# EAGLE design ATTinyx5 Utility Board (EAGLE 7.1.0)
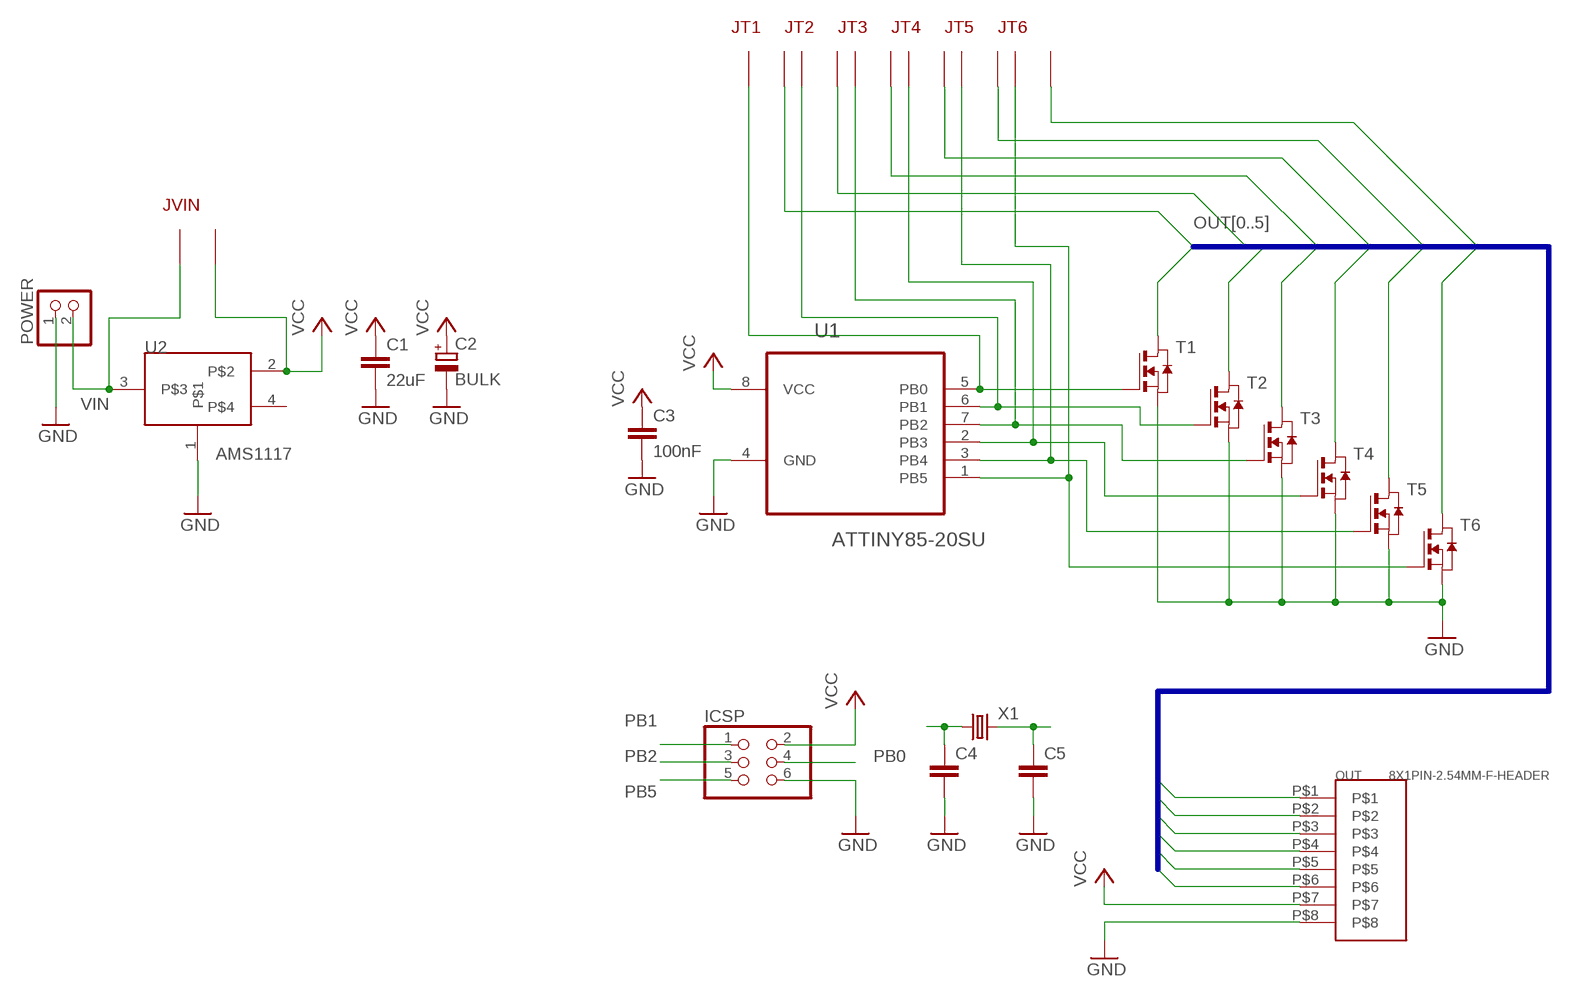
[diagram p0: schematic, sheet 1]

## Parts
C1  22uF  C-EUC1206  [C1206]
C2  BULK  CPOL-EUE3.5-10  [E3,5-10]
C3  100nF  C-EUC0805  [C0805]
C4  C-EUC0805  [C0805]
C5  C-EUC0805  [C0805]
ICSP  PINHD-2X3  [2X03]
JT1  SOLDER_JUMPER  [1206]
JT2  SOLDER_JUMPER  [1206]
JT3  SOLDER_JUMPER  [1206]
JT4  SOLDER_JUMPER  [1206]
JT5  SOLDER_JUMPER  [1206]
JT6  SOLDER_JUMPER  [1206]
JVIN  SOLDER_JUMPER  [1206]
OUT  8X1PIN-2.54MM-F-HEADER  [8X1-2.54MM]
POWER  PINHD-1X2  [1X02]
T1  NMOSSOT23  [SOT-23]
T2  NMOSSOT23  [SOT-23]
T3  NMOSSOT23  [SOT-23]
T4  NMOSSOT23  [SOT-23]
T5  NMOSSOT23  [SOT-23]
T6  NMOSSOT23  [SOT-23]
U1  ATTINY85-20SU  [SOIC127P798X216-8N]
U2  AMS1117  ASM1117-3.3  [SOT223]
X1  CRYSTALSM49  [SM49]

## Nets
GND: C1.2 C2.- C3.2 C4.2 C5.2 ICSP.6 OUT.P$8 POWER.1 T1.2(S) T2.2(S) T3.2(S) T4.2(S) T5.2(S) T6.2(S) U1.4(GND) U2.1
OUT0: JT1.P$2 OUT.P$1 T1.1(D)
OUT1: JT2.P$2 OUT.P$2 T2.1(D)
OUT2: JT3.P$2 OUT.P$3 T3.1(D)
OUT3: JT4.P$2 OUT.P$4 T4.1(D)
OUT4: JT5.P$2 OUT.P$5 T5.1(D)
OUT5: JT6.P$2 OUT.P$6 T6.1(D)
PB0: ICSP.4 JT1.P$1 T1.3(G) U1.5(PB0)
PB1: ICSP.1 JT2.P$1 T2.3(G) U1.6(PB1)
PB2: ICSP.3 JT3.P$1 T3.3(G) U1.7(PB2)
PB3: C4.1 JT4.P$1 T4.3(G) U1.2(PB3) X1.1
PB4: C5.1 JT5.P$1 T5.3(G) U1.3(PB4) X1.2
PB5: ICSP.5 JT6.P$1 T6.3(G) U1.1(PB5)
VCC: C1.1 C2.+ C3.1 ICSP.2 JVIN.P$2 OUT.P$7 U1.8(VCC) U2.2
VIN: JVIN.P$1 POWER.2 U2.3
Unconnected: U2.4

## Buses
OUT[0..5]

## Library data of the parts
C1 C3-C5 = rcl:C-EU: CAPACITOR, European symbol
C2 = rcl:CPOL-EU: POLARIZED CAPACITOR, European symbol
ICSP = pinhead:PINHD-2X3: PIN HEADER
JT1-JT6 JVIN = solder_jumper:SOLDER_JUMPER
OUT = Itead_BP_110825.lbr:8X1PIN-2.54MM-F-HEADER: CON019
POWER = pinhead:PINHD-1X2: PIN HEADER
T1-T6 = zetex:NMOSSOT23: MOS FET; OC_FARNELL: unknown; OC_NEWARK: unknown
U1 = Atmel_By_element14_Batch_1-00:ATTINY85-20SU: 8-bit Microcontroller with In-System Programmable Flash; MPN: ATTINY85-20SU; OC_FARNELL: 1455164; OC_NEWARK: 58M3797; PACKAGE: SOIC-8; SUPPLIER: Atmel
U2 = Itead_IC_110429:ASM1117-3.3: ICP006
X1 = adafruit:CRYSTAL: CRYSTAL; OC_FARNELL: unknown; OC_NEWARK: unknown

## Board
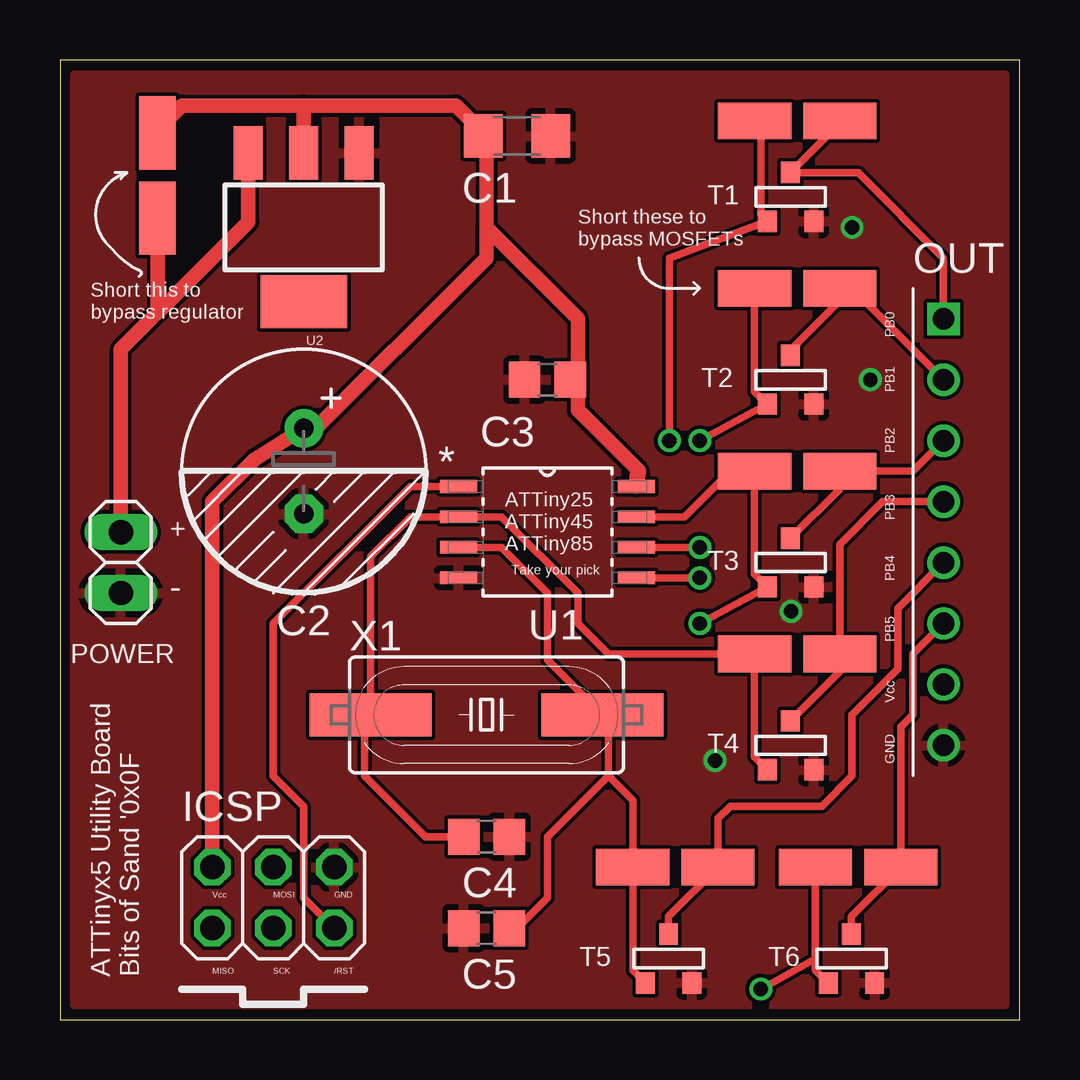
[diagram p1: board, top side]
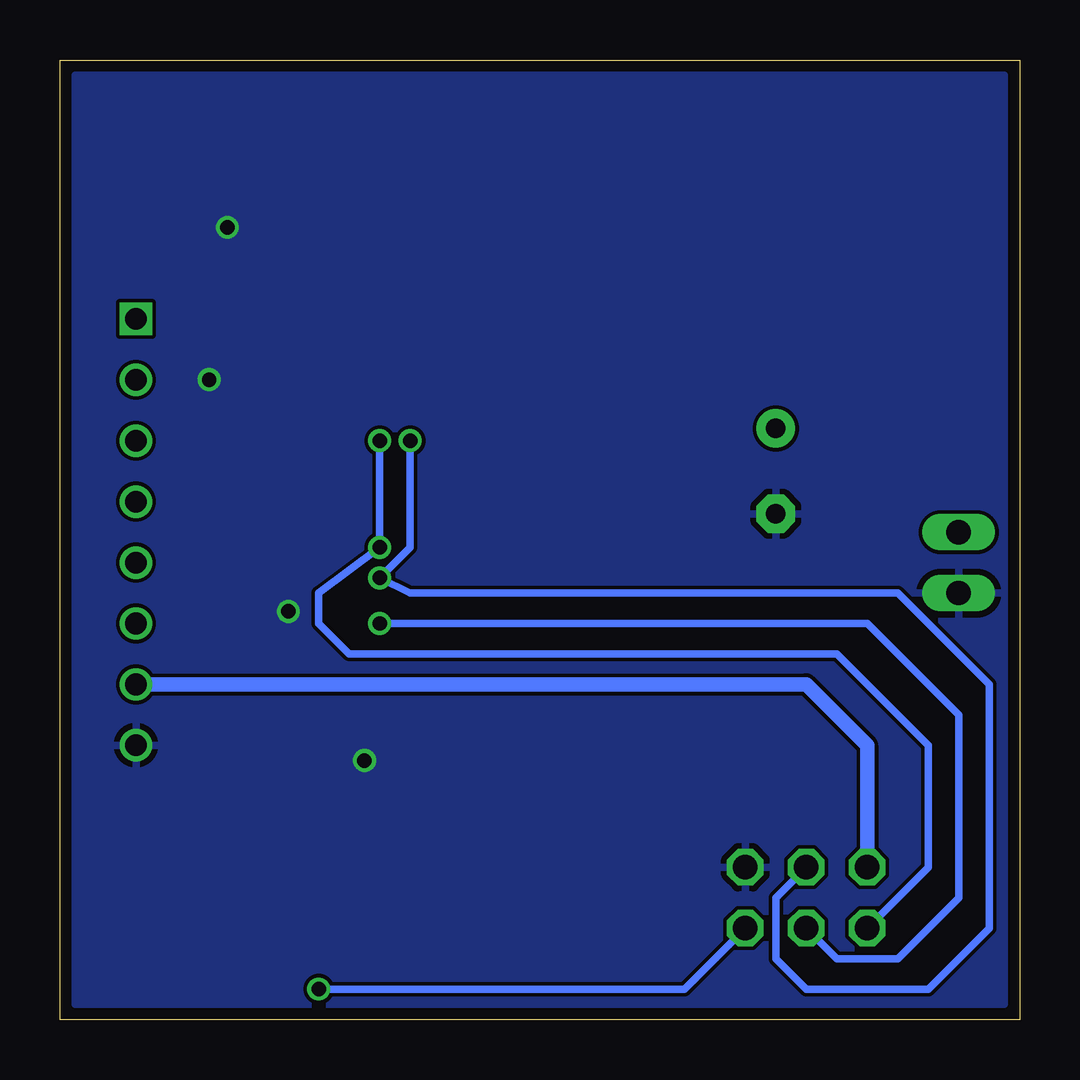
[diagram p2: board, bottom side, seen from below]

Size 40 x 40 mm. Coordinates in mm from the lower left corner, seen from the top.
Outline: 0,0 40,0 40,40 0,40 0,0
Copper layers (1*16): Top 0.0356mm / dielectric 1.5011mm / Bottom 0.0356mm
Design rules "LaenPCBOrder": minimum track width 6mil, minimum drill 13mil, track to track 6mil, track to pad 6mil, pad to pad 6mil, via to via 6mil, smd to smd 6mil, copper to edge 15mil, drill to drill 6mil, minimum pad ring 7mil, minimum via ring 7mil, stop-mask expansion 3mil, vias tented up to drill 0mil, thermal gap 10mil

### Footprints (pad centres in the part's own frame; a part is rotated, then mirrored left to right if it is on the bottom)
C1206 = smd 1.6 x 1.8: 1 -1.4,0; 2 1.4,0
E3,5-10 = drill 0.813 pad 1.6: + -1.778,0 | drill 0.813 pad 1.6 octagon: - 1.778,0
C0805 = smd 1.3 x 1.5: 1 -0.95,0; 2 0.95,0
2X03 = drill 1.016 octagon: 1 -2.54,-1.27; 2 -2.54,1.27; 3 0,-1.27; 4 0,1.27; 5 2.54,-1.27; 6 2.54,1.27
1206 = smd 3.048 x 1.524: P$1 -2.159,0; P$2 1.397,0
8X1-2.54MM = drill 0.9 square: P$1 0,0 | drill 0.9: P$2 0,-2.54; P$3 0,-5.08; P$4 0,-7.62; P$5 0,-10.16; P$6 0,-12.7; P$7 0,-15.24; P$8 0,-17.78
1X02 = drill 1.016 long: 1 -1.27,0; 2 1.27,0
SOT-23 = smd 0.787 x 0.889: 1 0.025,-1.016; 2 -0.94,1.016; 3 0.991,1.016
SOIC127P798X216-8N = smd 1.549 x 0.533: 1 -3.708,1.905; 2 -3.708,0.635; 3 -3.708,-0.635; 4 -3.708,-1.905; 5 3.708,-1.905; 6 3.708,-0.635; 7 3.708,0.635; 8 3.708,1.905
SOT223 = smd 1.219 x 2.235: 1 -2.311,-3.099; 2 0,-3.099; 3 2.311,-3.099 | smd 3.6 x 2.2: 4 0,3.099
SM49 = smd 5.08 x 1.778: 1 -4.826,0; 2 4.826,0

### Placement (x,y rotation side)
C1  19.05,36.83 0 top
C2  10.16,22.86 270 top
C3  20.32,26.67 180 top
C4  17.78,7.62 0 top
C5  17.78,3.81 180 top
ICSP  8.89,5.08 0 top
JT1  31.11,37.47 0 top
JT2  31.11,30.48 0 top
JT3  31.11,22.86 0 top
JT4  31.11,15.24 0 top
JT5  26.04,6.35 0 top
JT6  33.66,6.35 0 top
JVIN  4.06,35.56 90 top
OUT  36.83,29.21 0 top
POWER  2.54,19.05 90 top
T1  30.48,34.29 180 top
T2  30.48,26.67 180 top
T3  30.48,19.05 180 top
T4  30.48,11.43 180 top
T5  25.4,2.54 180 top
T6  33.02,2.54 180 top
U1  20.32,20.32 0 top
U2  10.16,33.02 180 top
X1  17.78,12.7 0 top

### Tracks (layer width: path | path; a pad name or v marks a point on that pad's centre or on a via)
GND  (via drill 0.6, 0.6 pad 0.25)
  other vias: 27.3,10.79 30.48,17.02 33.78,26.67 33.02,33.02
  pour Top: 0.64,39.37 39.37,39.37 39.37,0.64 0.64,0.64
  pour Bottom: 0.64,39.37 39.37,39.37 39.37,0.64 0.64,0.64
OUT0
  Top 0.305: JT1.P$2 32.51,37.36 T1.1 33.27,35.31 36.83,31.75 OUT.P$1
OUT1
  Top 0.305: JT2.P$2 32.51,29.97 | 32.51,29.97 30.48,27.94 30.48,27.71 T2.1 | 32.51,29.97 33.53,29.97 OUT.P$2
OUT2
  Top 0.305: T3.1 32.51,22.12 JT3.P$2 35.56,22.86 OUT.P$3
OUT3
  Top 0.305: T4.1 32.51,14.5 JT4.P$2 32.51,19.81 34.29,21.59 OUT.P$4
OUT4
  Top 0.305: T5.1 25.38,4.29 JT5.P$2 27.43,8.38 27.94,8.89 31.75,8.89 33.02,10.16 33.02,12.7 34.92,14.61 34.92,17.14 OUT.P$5
OUT5
  Top 0.305: T6.1 32.99,4.29 JT6.P$2 35.05,12.19 35.56,12.7 35.56,15.24 OUT.P$6
PB0  (via drill 0.6)
  Top 0.305: JT1.P$1 28.96,37.08 29.21,36.83 29.21,33.55 T1.3 25.4,31.75 v25.4,24.13 | v26.67,18.41 U1.5
  Bottom 0.305: v25.4,24.13 25.4,19.68 v26.67,18.41 25.4,17.78 5.08,17.78 1.27,13.97 1.27,3.81 3.81,1.27 8.89,1.27 10.16,2.54 10.16,5.08 ICSP.4
PB1  (via drill 0.6)
  Top 0.305: JT2.P$1 28.96,26.19 T2.3 v26.67,24.13 | v26.67,19.68 U1.6
  Bottom 0.305: v26.67,24.13 v26.67,19.68 29.21,17.78 29.21,16.51 27.94,15.24 7.62,15.24 3.81,11.43 3.81,6.35 ICSP.1
PB2  (via drill 0.6)
  Top 0.305: U1.7 26.04,20.95 27.94,22.86 JT3.P$1 28.96,18.57 T3.3 v26.67,16.51
  Bottom 0.305: ICSP.3 7.62,2.54 5.08,2.54 2.54,5.08 2.54,12.7 6.35,16.51 v26.67,16.51
PB3
  Top 0.305: T4.3 28.96,10.95 JT4.P$1 22.86,15.24 21.59,16.51 21.59,17.78 18.41,20.95 U1.2 14.61,20.95 12.95,19.3 X1.1 12.7,12.45 12.7,10.16 15.24,7.62 C4.1
PB4
  Top 0.305: T5.3 23.88,2.06 JT5.P$1 23.88,9.14 22.86,10.16 | C5.1 19.05,3.81 20.32,5.08 20.32,7.62 22.86,10.16 | 22.86,10.16 22.86,12.45 X1.2 20.32,14.99 20.32,17.78 18.41,19.68 U1.3
PB5  (via drill 0.6)
  Top 0.305: JT6.P$1 31.5,2.54 | 31.5,2.54 31.5,2.06 T6.3 | U1.1 14.61,22.23 8.89,16.51 8.89,10.16 10.16,8.89 10.16,5.08 ICSP.5 | v29.21,1.27 31.5,2.54
  Bottom 0.305: ICSP.5 13.97,1.27 v29.21,1.27
VCC
  Top 0.61: U2.2 10.16,38.1 | 10.16,38.1 16.51,38.1 17.78,36.83 C1.1 17.78,36.7 17.78,33.02 | 17.78,33.02 21.59,29.21 21.59,26.67 | 21.59,26.67 21.59,25.4 24.13,22.86 U1.8 24.03,22.64 | 17.78,33.02 17.78,31.75 10.16,24.13 C2.+ 8.13,23.37 6.35,21.59 ICSP.2 | JVIN.P$2 4.06,37.08 5.08,38.1 10.16,38.1 | C3.1 21.59,26.67
  Bottom 0.61: OUT.P$7 8.89,13.97 6.35,11.43 ICSP.2
VIN
  Top 0.61: 4.06,29.46 7.85,33.25 U2.3 | JVIN.P$1 4.06,29.46 | 4.06,29.46 3.81,29.21 2.54,27.94 POWER.2

### Text on the board
tPlace: Short these to / bypass MOSFETs | Short this to / bypass regulator | PB0 | PB1 | PB2 | PB3 | + | ATTiny25 / ATTiny45 / ATTiny85 | Take your pick | - | PB4 | PB5 | Vcc | GND | Vcc | MOSI | GND | ATTinyx5 Utility Board / Bits of Sand '0x0F | MISO | SCK | /RST